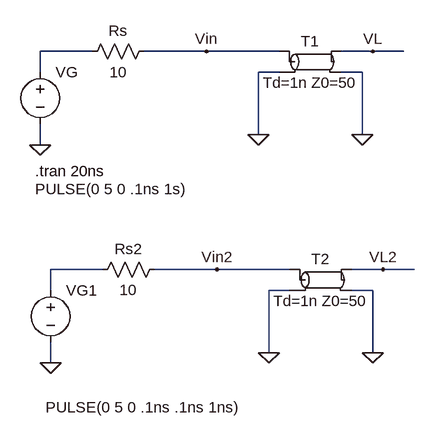
[diagram p0: schematic Tline_short_gradino.asc]
Tline_short_gradino.asc, the LTspice schematic file:
Version 4
SHEET 1 1300 692
WIRE 16 128 -64 128
WIRE 192 128 96 128
WIRE 304 128 192 128
WIRE 448 128 400 128
WIRE 496 128 448 128
WIRE -64 160 -64 128
WIRE 304 160 272 160
WIRE 432 160 400 160
WIRE 272 256 272 160
WIRE 432 256 432 160
WIRE -64 272 -64 240
WIRE 32 464 -48 464
WIRE 208 464 112 464
WIRE 320 464 208 464
WIRE 464 464 416 464
WIRE 512 464 464 464
WIRE -48 496 -48 464
WIRE 320 496 288 496
WIRE 448 496 416 496
WIRE 288 592 288 496
WIRE 448 592 448 496
WIRE -48 608 -48 576
FLAG -64 272 0
FLAG 272 256 0
FLAG 432 256 0
FLAG 192 128 Vin
FLAG 448 128 VL
FLAG -48 608 0
FLAG 288 592 0
FLAG 448 592 0
FLAG 208 464 Vin2
FLAG 464 464 VL2
SYMBOL voltage -64 144 R0
WINDOW 123 0 0 Left 0
WINDOW 39 0 0 Left 0
WINDOW 3 -8 196 Left 2
SYMATTR Value PULSE(0 5 0 .1ns 1s)
SYMATTR InstName VG
SYMBOL tline 352 144 R0
SYMATTR InstName T1
SYMATTR Value Td=1n Z0=50
SYMBOL res 112 112 R90
WINDOW 0 0 56 VBottom 2
WINDOW 3 32 56 VTop 2
SYMATTR InstName Rs
SYMATTR Value 10
SYMBOL voltage -48 480 R0
WINDOW 123 0 0 Left 0
WINDOW 39 0 0 Left 0
WINDOW 3 -8 196 Left 2
SYMATTR Value PULSE(0 5 0 .1ns .1ns 1ns)
SYMATTR InstName VG1
SYMBOL tline 368 480 R0
SYMATTR InstName T2
SYMATTR Value Td=1n Z0=50
SYMBOL res 128 448 R90
WINDOW 0 0 56 VBottom 2
WINDOW 3 32 56 VTop 2
SYMATTR InstName Rs2
SYMATTR Value 10
TEXT -72 312 Left 2 !.tran 20ns

The netlist it stands for:
* Tline_short_gradino.asc
VG N001 0 PULSE(0 5 0 .1ns 1s)
T1 Vin 0 VL 0 Td=1n Z0=50
Rs Vin N001 10
VG1 N002 0 PULSE(0 5 0 .1ns .1ns 1ns)
T2 Vin2 0 VL2 0 Td=1n Z0=50
Rs2 Vin2 N002 10
.tran 20ns
.backanno
.end